# Altium project mxiot.PrjPcb
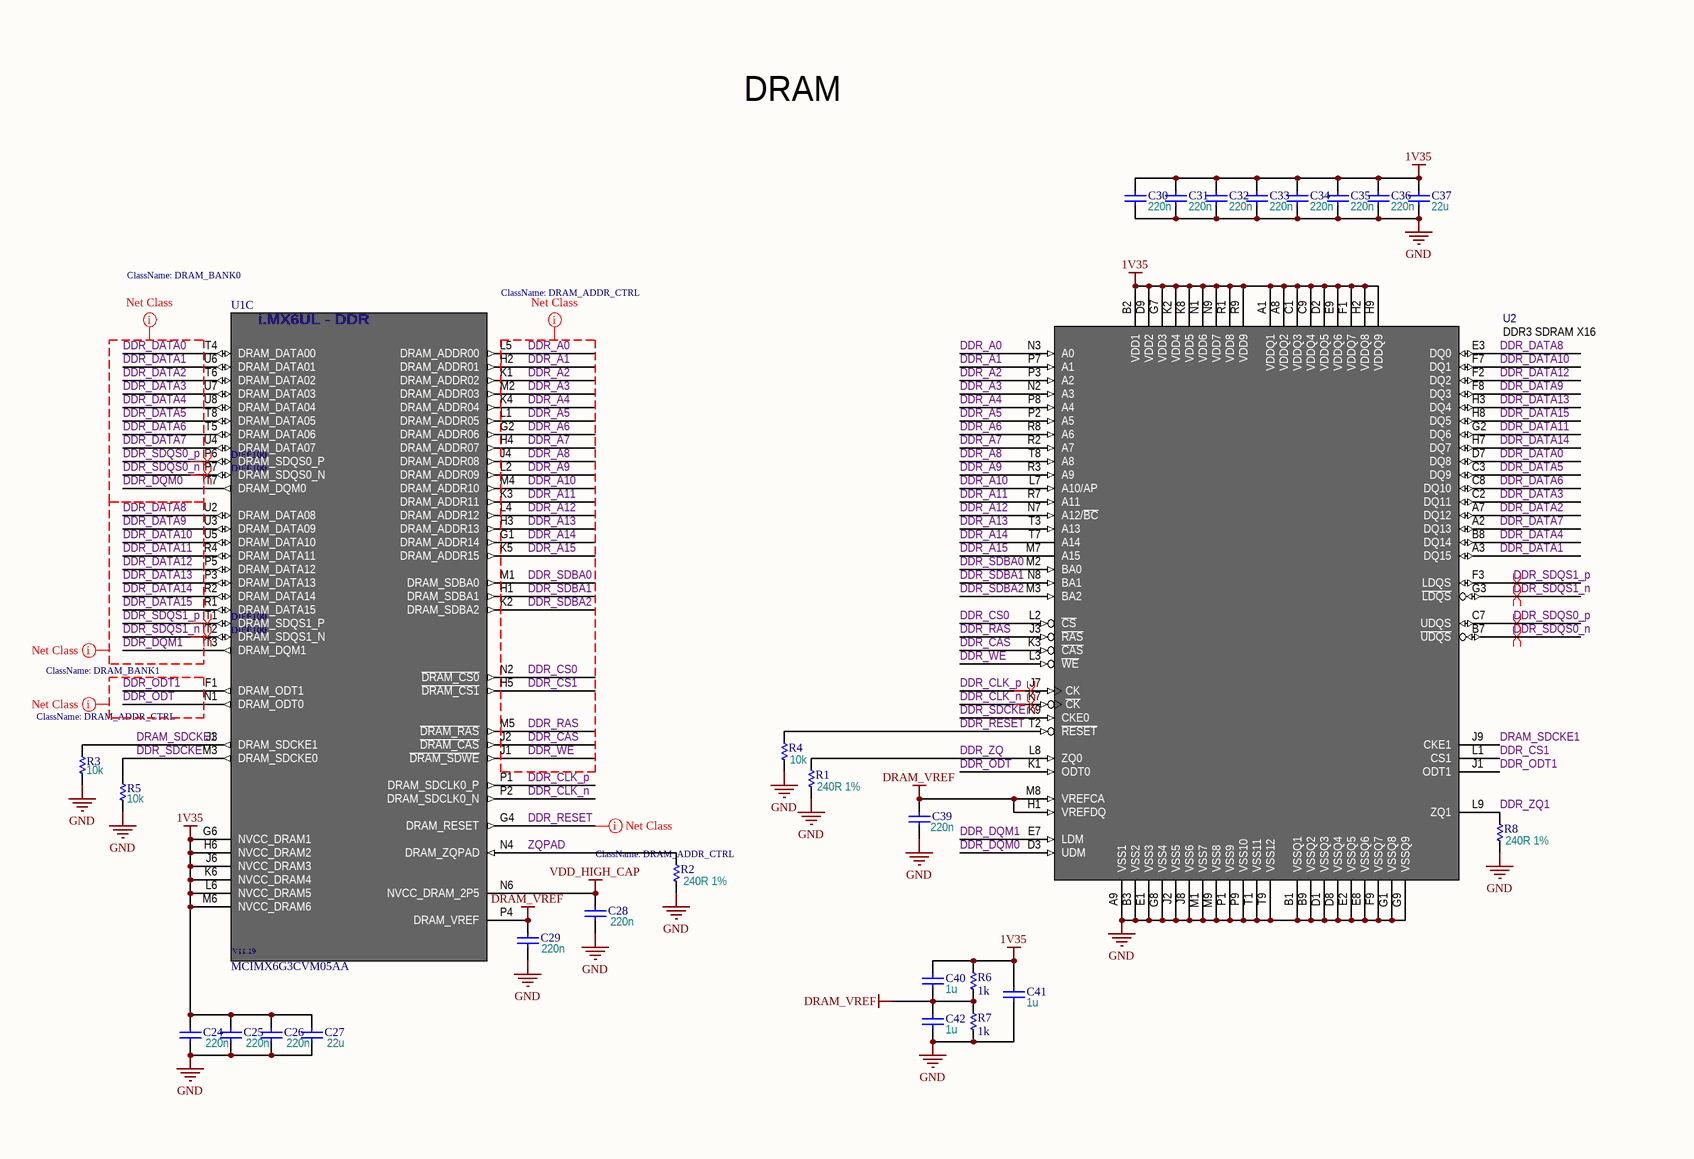
[diagram p0: mxiot.SchDoc, top left]
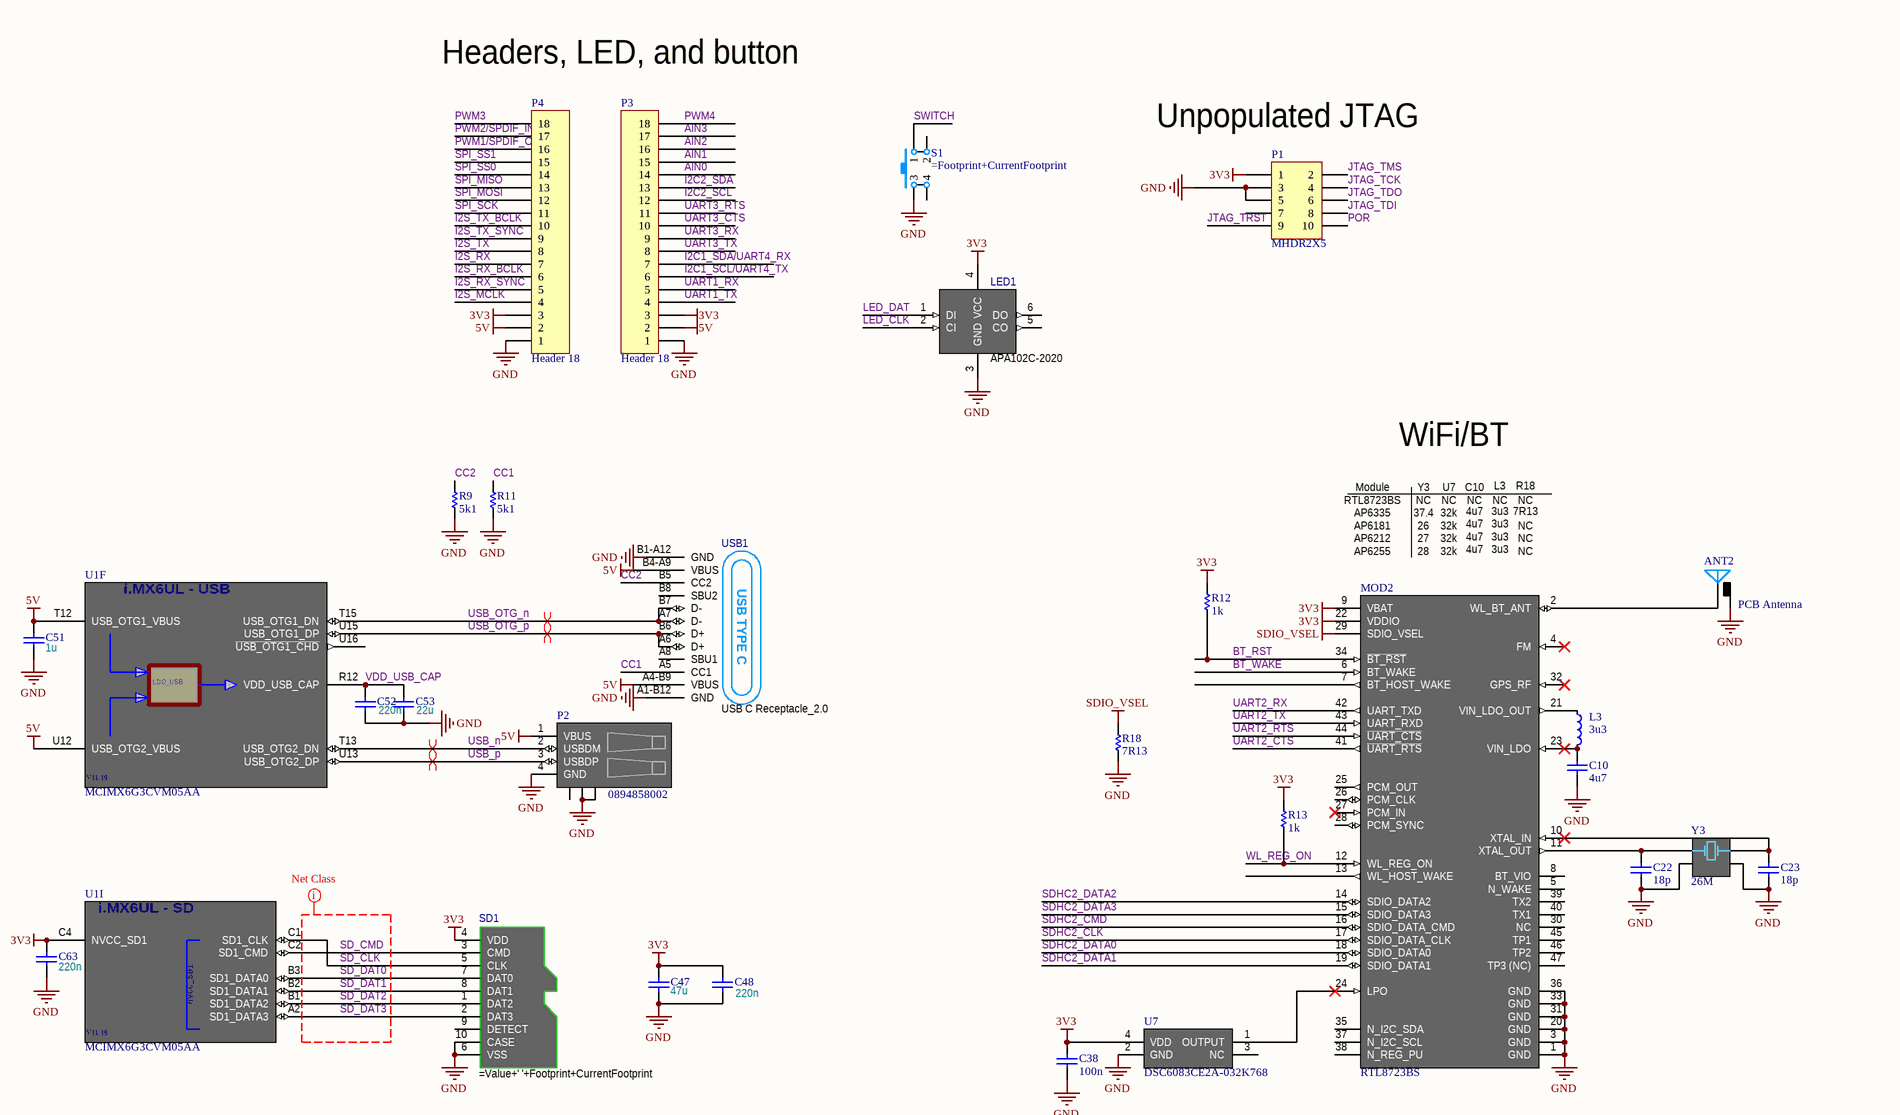
[diagram p1: mxiot.SchDoc, top right]
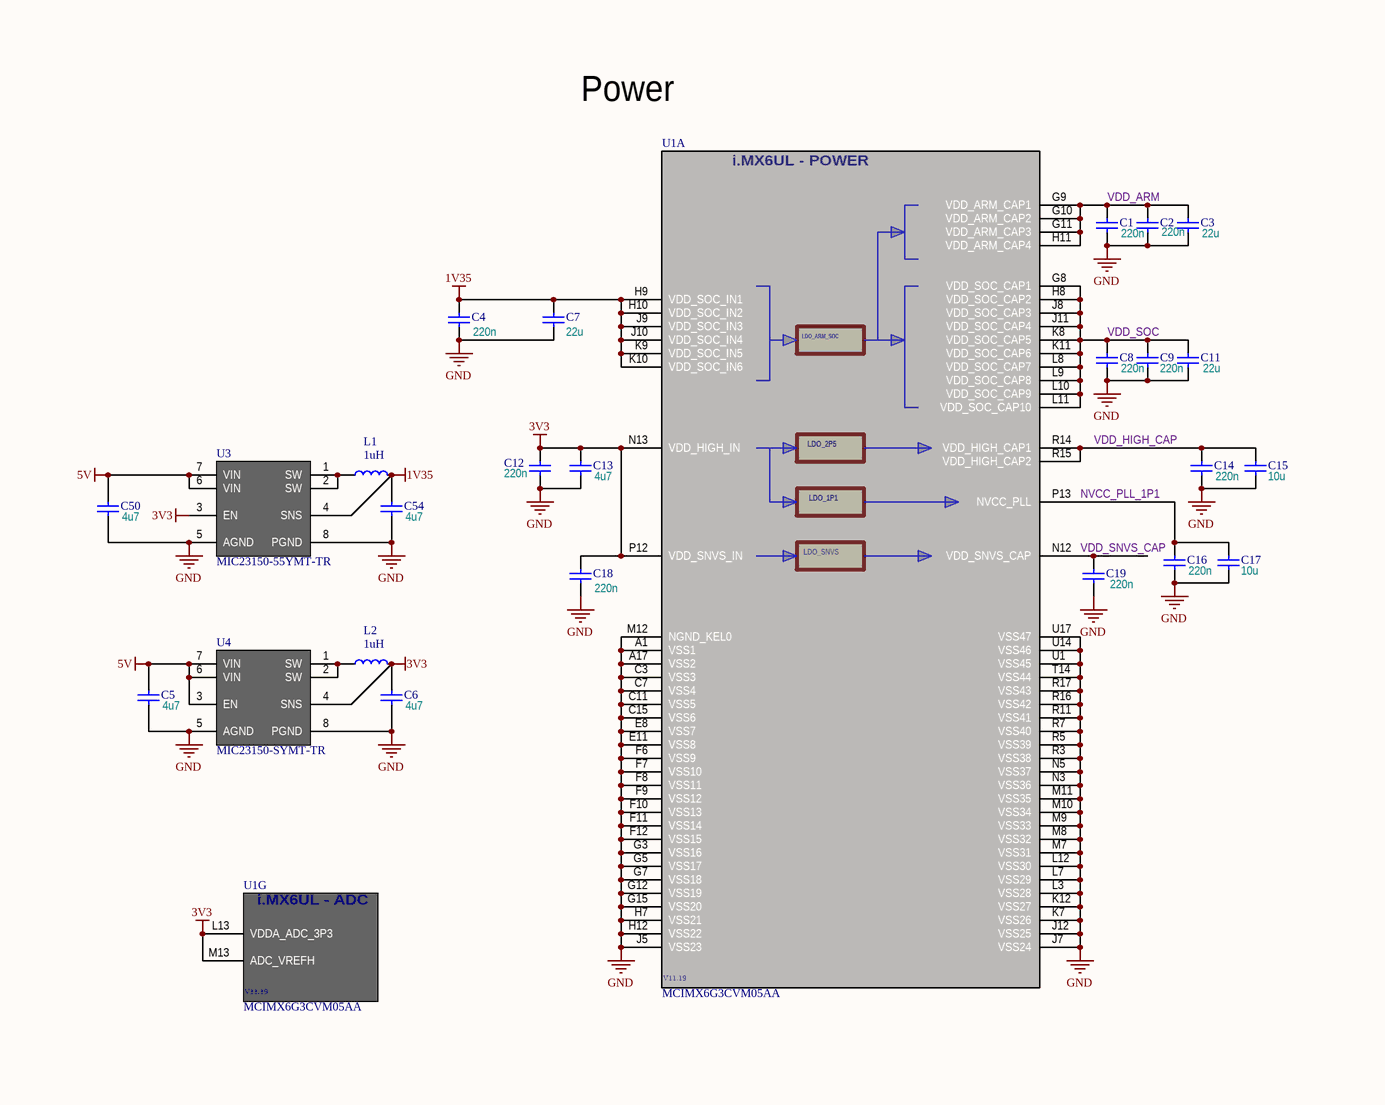
[diagram p2: mxiot.SchDoc, bottom left]
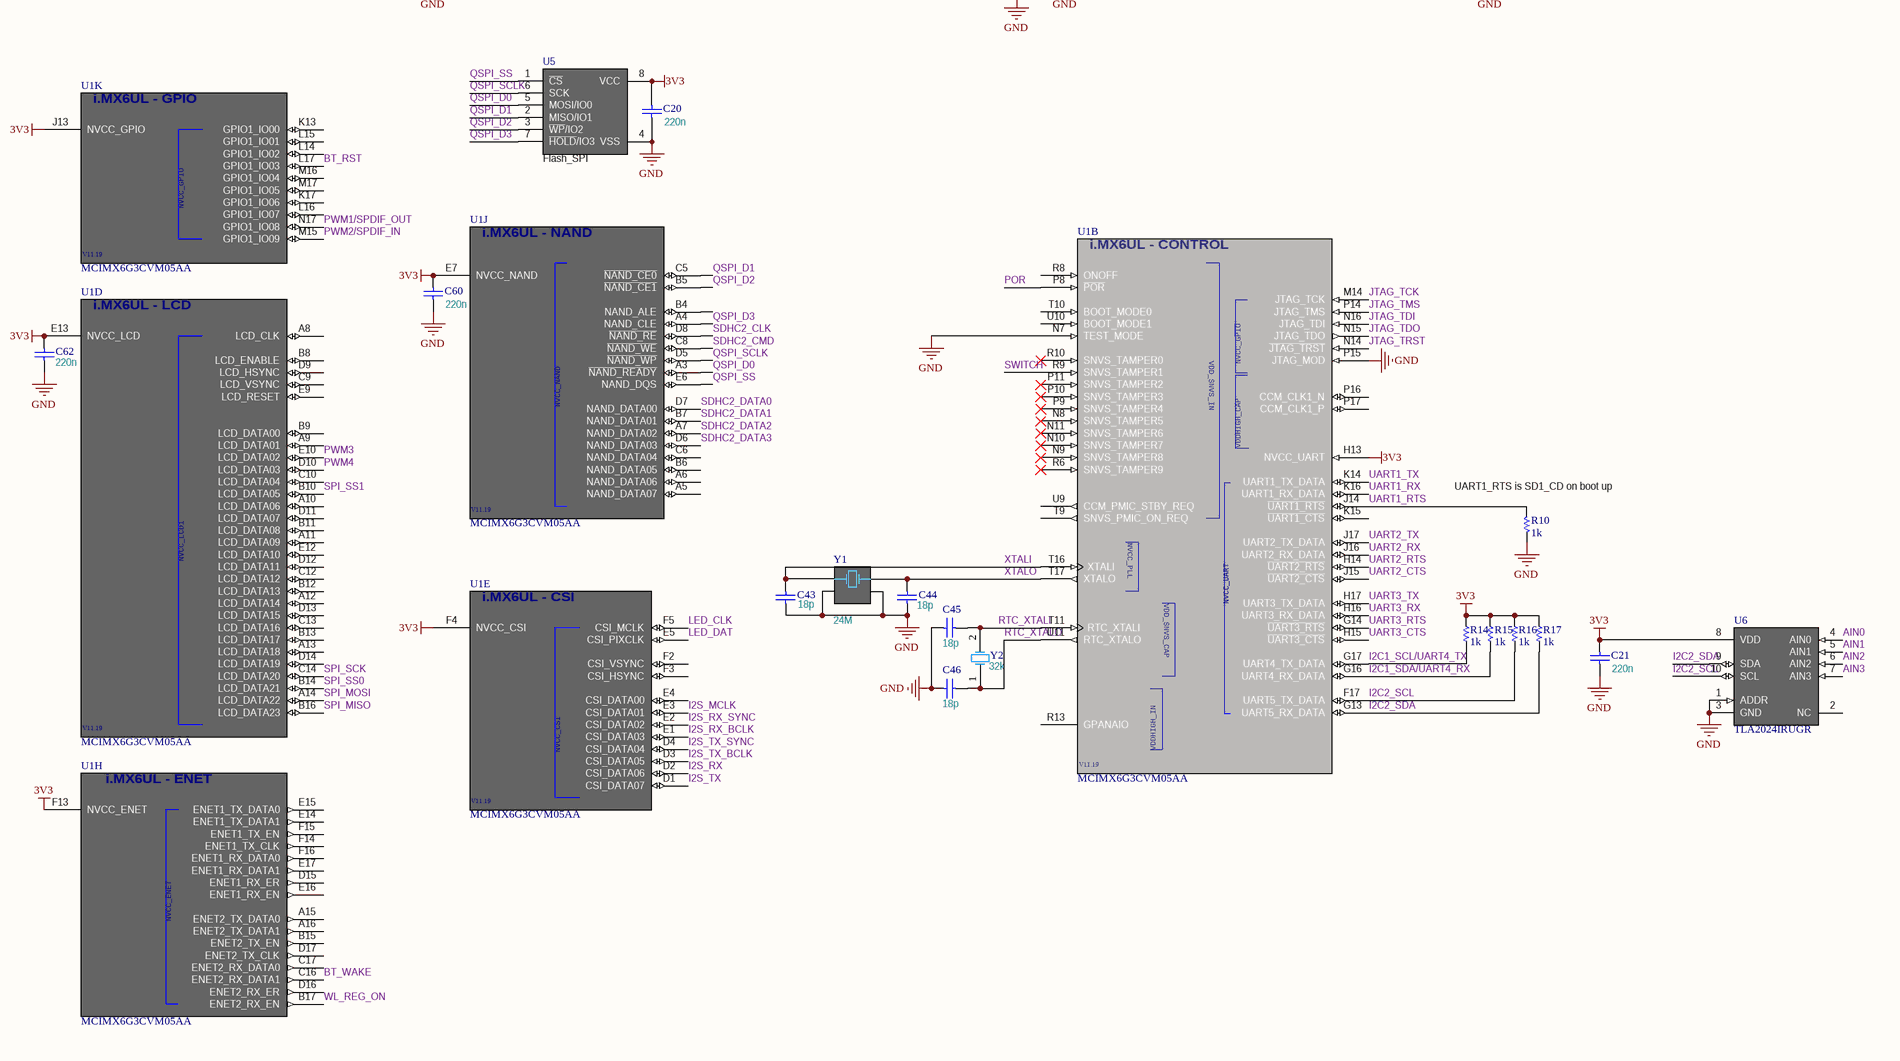
[diagram p3: mxiot.SchDoc, bottom right]
1 sheet, 97 parts. Net scope: global (net labels, ports and power ports of the same name join across sheets).
Board file: mxiot.PcbDoc

## Sheet mxiot.SchDoc
size 762 x 457 mm

### Parts
ANT2  PCB Antenna  [AN043FLIPPED]  (net tie, no BOM)
C1  value 220n  [CAPC1005N]
C2  value 220n  [CAPC1005N]
C3  value 22u  [CAPC1608N]
C4  value 220n  [CAPC1005N]
C5  value 4u7  [CAPC1608N]
C6  value 4u7  [CAPC1608N]
C7  value 22u  [CAPC1608N]
C8  value 220n  [CAPC1005N]
C9  value 220n  [CAPC1005N]
C10  4u7  [CAPC1608N]  (no BOM)
C11  value 22u  [CAPC1608N]
C12  value 220n  [CAPC1005N]
C13  value 4u7  [CAPC1608N]
C14  value 220n  [CAPC1005N]
C15  value 10u  [CAPC1608N]
C16  value 220n  [CAPC1005N]
C17  value 10u  [CAPC1608N]
C18  value 220n  [CAPC1005N]
C19  value 220n  [CAPC1005N]
C20  value 220n  [CAPC1005N]
C21  value 220n  [CAPC1005N]
C22  18p  [CAPC1005N]  (no BOM)
C23  18p  [CAPC1005N]  (no BOM)
C24  value 220n  [CAPC1005N]
C25  value 220n  [CAPC1005N]
C26  value 220n  [CAPC1005N]
C27  value 22u  [CAPC1608N]
C28  value 220n  [CAPC1005N]
C29  value 220n  [CAPC1005N]
C30  value 220n  [CAPC1005N]
C31  value 220n  [CAPC1005N]
C32  value 220n  [CAPC1005N]
C33  value 220n  [CAPC1005N]
C34  value 220n  [CAPC1005N]
C35  value 220n  [CAPC1005N]
C36  value 220n  [CAPC1005N]
C37  value 22u  [CAPC1608N]
C38  100n  [CAPC1005N]  (no BOM)
C39  value 220n  [CAPC1005N]
C40  value 1u  [CAPC1005N]
C41  value 1u  [CAPC1005N]
C42  value 1u  [CAPC1005N]
C43  value 18p  [CAPC1005N]
C44  value 18p  [CAPC1005N]
C45  value 18p  [CAPC1005N]
C46  value 18p  [CAPC1005N]
C47  value 47u  [CAPC2012L]
C48  value 220n  [CAPC1005N]
C50  value 4u7  [CAPC1608N]
C51  value 1u  [CAPC1005N]
C52  value 220n  [CAPC1005N]
C53  value 22u  [CAPC1608N]
C54  value 4u7  [CAPC1608N]
C60  value 220n  [CAPC1005N]
C62  value 220n  [CAPC1005N]
C63  value 220n  [CAPC1005N]
L1  value 1uH  [INDC2520X12N]
L2  value 1uH  [INDC2520X12N]
L3  value 3u3  [INDC2520X12N]  (hidden comment: Inductor)  (no BOM)
LED1  APA102C-2020  [APA102-2020]
MOD2  RTL8723BS  [AP1212_44N]
P1  MHDR2X5  [MHDR2X5SMD]  (no BOM)
P2  0894858002  [0894858002]
P3  Header 18  [HDR1X18]
P4  Header 18  [HDR1X18]
R1  value 240R 1%  [RESC1005N]
R2  value 240R 1%  [RESC1005N]
R3  value 10k  [RESC1005N]
R4  value 10k  [RESC1005N]
R5  value 10k  [RESC1005N]
R6  value 1k  [RESC1005N]
R7  value 1k  [RESC1005N]
R8  value 240R 1%  [RESC1005N]
R9  value 5k1  [RESC1005N]
R10  value 1k  [RESC1005N]
R11  value 5k1  [RESC1005N]
R12  value 1k  [RESC1005N]
R13  value 1k  [RESC1005N]
R14  value 1k  [RESC1005N]
R15  value 1k  [RESC1005N]
R16  value 1k  [RESC1005N]
R17  value 1k  [RESC1005N]
R18  7R13  [RESC1005N]  (no BOM)
S1  (no value)  [TACTILE-SW-SMD-4.2X3.2X2.5]
SD1  (no value)  [47309-2851]
U1  MCIMX6G3CVM05AA  [BGA289C80P17X17_1400X1400X132]  (parts A,B,C,D,E,F,G,H,I,J,K of 11)
U2  DDR3 SDRAM X16  [BGA96C80P9X16_COMBO]
U3  MIC23150-55YMT-TR  [DFN50P200X80-8N]
U4  MIC23150-SYMT-TR  [DFN50P200X80-8N]
U5  Flash_SPI  [SON127P800X80_HS-COMBO-9N]
U6  TLA2024IRUGR  [RUG_N]
U7  DSC6083CE2A-032K768  [XTAL3225-4-N]  (no BOM)
USB1  USB C Receptacle_2.0  [TYPE-C16PIN-CONNECTOR]
Y1  value 24M  [XTAL3225-4-N]
Y2  value 32k  [ABS07]
Y3  26M  [XTAL3225-4-N]  (no BOM)

### Nets
1V35: C4.2 C7.2 C24.2 C25.2 C26.2 C27.2 C30.2 C31.2 C32.2 C33.2 C34.2 C35.2 C36.2 C37.2 C40.2 C41.2 C54.2 L1.2 R6.2 U1.G6(NVCC_DRAM1) U1.H6(NVCC_DRAM2) U1.H9(VDD_SOC_IN1) U1.H10(VDD_SOC_IN2) U1.J6(NVCC_DRAM3) U1.J9(VDD_SOC_IN3) U1.J10(VDD_SOC_IN4) U1.K6(NVCC_DRAM4) U1.K9(VDD_SOC_IN5) U1.K10(VDD_SOC_IN6) U1.L6(NVCC_DRAM5) U1.M6(NVCC_DRAM6) U2.A1(VDDQ1) U2.A8(VDDQ2) U2.B2(VDD1) U2.C1(VDDQ3) U2.C9(VDDQ4) U2.D2(VDDQ5) U2.D9(VDD2) U2.E9(VDDQ6) U2.F1(VDDQ7) U2.G7(VDD3) U2.H2(VDDQ8) U2.H9(VDDQ9) U2.K2(VDD4) U2.K8(VDD5) U2.N1(VDD6) U2.N9(VDD7) U2.R1(VDD8) U2.R9(VDD9) U3.4(SNS)
3V3: C6.2 C12.2 C13.2 C18.2 C20.2 C21.2 C38.2 C47.2 C48.2 C60.2 C62.2 C63.2 L2.2 LED1.4(VCC) MOD2.9(VBAT) MOD2.22(VDDIO) P1.1 P3.3 P4.3 R12.2 R13.2 R14.2 R15.2 R16.2 R17.2 SD1.4(VDD) U1.C4(NVCC_SD1) U1.E7(NVCC_NAND) U1.E13(NVCC_LCD) U1.F4(NVCC_CSI) U1.F13(NVCC_ENET) U1.H13(NVCC_UART) U1.J13(NVCC_GPIO) U1.L13(VDDA_ADC_3P3) U1.M13(ADC_VREFH) U1.N13(VDD_HIGH_IN) U1.P12(VDD_SNVS_IN) U3.3(EN) U4.4(SNS) U5.8(VCC) U6.8(VDD) U7.4(VDD)
5V: C5.2 C50.2 C51.2 P2.1(VBUS) P3.2 P4.2 U1.T12(USB_OTG1_VBUS) U1.U12(USB_OTG2_VBUS) U3.6(VIN) U3.7(VIN) U4.3(EN) U4.6(VIN) U4.7(VIN) USB1.A4-B9(VBUS) USB1.B4-A9(VBUS)
DRAM_VREF: C29.2 C39.2 C40.1 C42.2 R6.1 R7.2 U1.P4(DRAM_VREF) U2.H1(VREFDQ) U2.M8(VREFCA)
GND: ANT2.2(GND) C1.1 C2.1 C3.1 C4.1 C5.1 C6.1 C7.1 C8.1 C9.1 C10.1 C11.1 C12.1 C13.1 C14.1 C15.1 C16.1 C17.1 C18.1 C19.1 C20.1 C21.1 C22.1 C23.1 C24.1 C25.1 C26.1 C27.1 C28.1 C29.1 C30.1 C31.1 C32.1 C33.1 C34.1 C35.1 C36.1 C37.1 C38.1 C39.1 C41.1 C42.1 C43.1 C44.1 C45.1 C46.1 C47.1 C48.1 C50.1 C51.1 C52.1 C53.1 C54.1 C60.1 C62.1 C63.1 LED1.3(GND) MOD2.1(GND) MOD2.3(GND) MOD2.20(GND) MOD2.31(GND) MOD2.33(GND) MOD2.36(GND) P1.3 P1.5 P2.4(GND) P2.MH1 P2.MH2 P3.1 P4.1 R1.2 R2.2 R3.1 R4.1 R5.1 R7.1 R8.2 R9.1 R10.1 R11.1 R18.1 S1.3 SD1.6(VSS) SD1.10(CASE) U1.A1(VSS1) U1.A17(VSS2) U1.C3(VSS3) U1.C7(VSS4) U1.C11(VSS5) U1.C15(VSS6) U1.E8(VSS7) U1.E11(VSS8) U1.F6(VSS9) U1.F7(VSS10) U1.F8(VSS11) U1.F9(VSS12) U1.F10(VSS13) U1.F11(VSS14) U1.F12(VSS15) U1.G3(VSS16) U1.G5(VSS17) U1.G7(VSS18) U1.G12(VSS19) U1.G15(VSS20) U1.H7(VSS21) U1.H12(VSS22) U1.J5(VSS23) U1.J7(VSS24) U1.J12(VSS25) U1.K7(VSS26) U1.K12(VSS27) U1.L3(VSS28) U1.L7(VSS29) U1.L12(VSS30) U1.M7(VSS31) U1.M8(VSS32) U1.M9(VSS33) U1.M10(VSS34) U1.M11(VSS35) U1.M12(NGND_KEL0) U1.N3(VSS36) U1.N5(VSS37) U1.N7(TEST_MODE) U1.P15(JTAG_MOD) U1.R3(VSS38) U1.R5(VSS39) U1.R7(VSS40) U1.R11(VSS41) U1.R16(VSS42) U1.R17(VSS43) U1.T14(VSS44) U1.U1(VSS45) U1.U14(VSS46) U1.U17(VSS47) U2.A9(VSS1) U2.B1(VSSQ1) U2.B3(VSS2) U2.B9(VSSQ2) U2.D1(VSSQ3) U2.D8(VSSQ4) U2.E1(VSS3) U2.E2(VSSQ5) U2.E8(VSSQ6) U2.F9(VSSQ7) U2.G1(VSSQ8) U2.G8(VSS4) U2.G9(VSSQ9) U2.J2(VSS5) U2.J8(VSS6) U2.M1(VSS7) U2.M9(VSS8) U2.P1(VSS9) U2.P9(VSS10) U2.T1(VSS11) U2.T9(VSS12) U3.5(AGND) U3.8(PGND) U4.5(AGND) U4.8(PGND) U5.4(VSS) U6.1(ADDR) U6.3(GND) U7.2(GND) USB1.A1-B12(GND) USB1.B1-A12(GND) Y1.2 Y1.4 Y3.2 Y3.4
SDIO_VSEL: MOD2.29(SDIO_VSEL) R18.2
VDD_HIGH_CAP: C14.2 C15.2 C28.2 U1.N6(NVCC_DRAM_2P5) U1.R14(VDD_HIGH_CAP1) U1.R15(VDD_HIGH_CAP2)
AIN0: P3.14 U6.4(AIN0)
AIN1: P3.15 U6.5(AIN1)
AIN2: P3.16 U6.6(AIN2)
AIN3: P3.17 U6.7(AIN3)
BT_RST: MOD2.34(~{BT_RST}) R12.1 U1.L17(GPIO1_IO03)
BT_WAKE: MOD2.6(BT_WAKE) U1.C16(ENET2_RX_DATA1)
CC1: R11.2 USB1.A5(CC1)
CC2: R9.2 USB1.B5(CC2)
DDR_A0: U1.L5(DRAM_ADDR00) U2.N3(A0)
DDR_A1: U1.H2(DRAM_ADDR01) U2.P7(A1)
DDR_A2: U1.K1(DRAM_ADDR02) U2.P3(A2)
DDR_A3: U1.M2(DRAM_ADDR03) U2.N2(A3)
DDR_A4: U1.K4(DRAM_ADDR04) U2.P8(A4)
DDR_A5: U1.L1(DRAM_ADDR05) U2.P2(A5)
DDR_A6: U1.G2(DRAM_ADDR06) U2.R8(A6)
DDR_A7: U1.H4(DRAM_ADDR07) U2.R2(A7)
DDR_A8: U1.J4(DRAM_ADDR08) U2.T8(A8)
DDR_A9: U1.L2(DRAM_ADDR09) U2.R3(A9)
DDR_A10: U1.M4(DRAM_ADDR10) U2.L7(A10/AP)
DDR_A11: U1.K3(DRAM_ADDR11) U2.R7(A11)
DDR_A12: U1.L4(DRAM_ADDR12) U2.N7(A12/~{BC})
DDR_A13: U1.H3(DRAM_ADDR13) U2.T3(A13)
DDR_A14: U1.G1(DRAM_ADDR14) U2.T7(A14)
DDR_A15: U1.K5(DRAM_ADDR15) U2.M7(A15)
DDR_CAS: U1.J2(~{DRAM_CAS}) U2.K3(~{CAS})
DDR_CLK_n: U1.P2(DRAM_SDCLK0_N) U2.K7(~{CK})
DDR_CLK_p: U1.P1(DRAM_SDCLK0_P) U2.J7(CK)
DDR_CS0: U1.N2(~{DRAM_CS0}) U2.L2(~{CS})
DDR_CS1: U1.H5(~{DRAM_CS1}) U2.L1(CS1)
DDR_DATA0: U1.T4(DRAM_DATA00) U2.D7(DQ8)
DDR_DATA1: U1.U6(DRAM_DATA01) U2.A3(DQ15)
DDR_DATA2: U1.T6(DRAM_DATA02) U2.A7(DQ12)
DDR_DATA3: U1.U7(DRAM_DATA03) U2.C2(DQ11)
DDR_DATA4: U1.U8(DRAM_DATA04) U2.B8(DQ14)
DDR_DATA5: U1.T8(DRAM_DATA05) U2.C3(DQ9)
DDR_DATA6: U1.T5(DRAM_DATA06) U2.C8(DQ10)
DDR_DATA7: U1.U4(DRAM_DATA07) U2.A2(DQ13)
DDR_DATA8: U1.U2(DRAM_DATA08) U2.E3(DQ0)
DDR_DATA9: U1.U3(DRAM_DATA09) U2.F8(DQ3)
DDR_DATA10: U1.U5(DRAM_DATA10) U2.F7(DQ1)
DDR_DATA11: U1.R4(DRAM_DATA11) U2.G2(DQ6)
DDR_DATA12: U1.P5(DRAM_DATA12) U2.F2(DQ2)
DDR_DATA13: U1.P3(DRAM_DATA13) U2.H3(DQ4)
DDR_DATA14: U1.R2(DRAM_DATA14) U2.H7(DQ7)
DDR_DATA15: U1.R1(DRAM_DATA15) U2.H8(DQ5)
DDR_DQM0: U1.T7(DRAM_DQM0) U2.D3(UDM)
DDR_DQM1: U1.T3(DRAM_DQM1) U2.E7(LDM)
DDR_ODT: U1.N1(DRAM_ODT0) U2.K1(ODT0)
DDR_ODT1: U1.F1(DRAM_ODT1) U2.J1(ODT1)
DDR_RAS: U1.M5(~{DRAM_RAS}) U2.J3(~{RAS})
DDR_RESET: R4.2 U1.G4(DRAM_RESET) U2.T2(~{RESET})
DDR_SDBA0: U1.M1(DRAM_SDBA0) U2.M2(BA0)
DDR_SDBA1: U1.H1(DRAM_SDBA1) U2.N8(BA1)
DDR_SDBA2: U1.K2(DRAM_SDBA2) U2.M3(BA2)
DDR_SDCKE: R5.2 U1.M3(DRAM_SDCKE0) U2.K9(CKE0)
DDR_SDQS0_n: U1.P7(DRAM_SDQS0_N) U2.B7(~{UDQS})
DDR_SDQS0_p: U1.P6(DRAM_SDQS0_P) U2.C7(UDQS)
DDR_SDQS1_n: U1.T2(DRAM_SDQS1_N) U2.G3(~{LDQS})
DDR_SDQS1_p: U1.T1(DRAM_SDQS1_P) U2.F3(LDQS)
DDR_WE: U1.J1(~{DRAM_SDWE}) U2.L3(~{WE})
DDR_ZQ: R1.1 U2.L8(ZQ0)
DDR_ZQ1: R8.1 U2.L9(ZQ1)
DRAM_SDCKE1: R3.2 U1.J3(DRAM_SDCKE1) U2.J9(CKE1)
I2C1_SCL/UART4_TX: P3.6 R14.1 U1.G17(UART4_TX_DATA)
I2C1_SDA/UART4_RX: P3.7 R15.1 U1.G16(UART4_RX_DATA)
I2C2_SCL: P3.12 R16.1 U1.F17(UART5_TX_DATA) U6.10(SCL)
I2C2_SDA: P3.13 R17.1 U1.G13(UART5_RX_DATA) U6.9(SDA)
I2S_MCLK: P4.4 U1.E3(CSI_DATA01)
I2S_RX: P4.7 U1.D2(CSI_DATA06)
I2S_RX_BCLK: P4.6 U1.E1(CSI_DATA03)
I2S_RX_SYNC: P4.5 U1.E2(CSI_DATA02)
I2S_TX: P4.8 U1.D1(CSI_DATA07)
I2S_TX_BCLK: P4.10 U1.D3(CSI_DATA05)
I2S_TX_SYNC: P4.9 U1.D4(CSI_DATA04)
JTAG_TCK: P1.4 U1.M14(JTAG_TCK)
JTAG_TDI: P1.8 U1.N16(JTAG_TDI)
JTAG_TDO: P1.6 U1.N15(JTAG_TDO)
JTAG_TMS: P1.2 U1.P14(JTAG_TMS)
JTAG_TRST: P1.9 U1.N14(~{JTAG_TRST})
LED_CLK: LED1.2(CI) U1.F5(CSI_MCLK)
LED_DAT: LED1.1(DI) U1.E5(CSI_PIXCLK)
NVCC_PLL_1P1: C16.2 C17.2 U1.P13(NVCC_PLL)
POR: P1.10 U1.P8(~{POR})
PWM1/SPDIF_OUT: P4.16 U1.N17(GPIO1_IO08)
PWM2/SPDIF_IN: P4.17 U1.M15(GPIO1_IO09)
PWM3: P4.18 U1.E10(LCD_DATA02)
PWM4: P3.18 U1.D10(LCD_DATA03)
QSPI_D0: U1.A3(~{NAND_READY}) U5.5(MOSI/IO0)
QSPI_D1: U1.C5(~{NAND_CE0}) U5.2(MISO/IO1)
QSPI_D2: U1.B5(~{NAND_CE1}) U5.3(~{WP}/IO2)
QSPI_D3: U1.A4(NAND_CLE) U5.7(~{HOLD}/IO3)
QSPI_SCLK: U1.D5(~{NAND_WP}) U5.6(SCK)
QSPI_SS: U1.E6(NAND_DQS) U5.1(~{CS})
RTC_XTALI: C45.2 U1.T11(RTC_XTALI) Y2.2(OSC2)
RTC_XTALO: C46.2 U1.U11(RTC_XTALO) Y2.1(OSC1)
SD_CLK: SD1.5(CLK) U1.C1(SD1_CLK)
SD_CMD: SD1.3(CMD) U1.C2(SD1_CMD)
SD_DAT0: SD1.7(DAT0) U1.B3(SD1_DATA0)
SD_DAT1: SD1.8(DAT1) U1.B2(SD1_DATA1)
SD_DAT2: SD1.1(DAT2) U1.B1(SD1_DATA2)
SD_DAT3: SD1.2(DAT3) U1.A2(SD1_DATA3)
SDHC2_CLK: MOD2.17(SDIO_DATA_CLK) U1.D8(~{NAND_RE})
SDHC2_CMD: MOD2.16(SDIO_DATA_CMD) U1.C8(~{NAND_WE})
SDHC2_DATA0: MOD2.18(SDIO_DATA0) U1.D7(NAND_DATA00)
SDHC2_DATA1: MOD2.19(SDIO_DATA1) U1.B7(NAND_DATA01)
SDHC2_DATA2: MOD2.14(SDIO_DATA2) U1.A7(NAND_DATA02)
SDHC2_DATA3: MOD2.15(SDIO_DATA3) U1.D6(NAND_DATA03)
SPI_MISO: P4.13 U1.B16(LCD_DATA23)
SPI_MOSI: P4.12 U1.A14(LCD_DATA22)
SPI_SCK: P4.11 U1.C14(LCD_DATA20)
SPI_SS0: P4.14 U1.B14(LCD_DATA21)
SPI_SS1: P4.15 U1.B10(LCD_DATA05)
SWITCH: S1.1 U1.R9(SNVS_TAMPER1)
UART1_RTS: R10.2 U1.J14(~{UART1_RTS})
UART1_RX: P3.5 U1.K16(UART1_RX_DATA)
UART1_TX: P3.4 U1.K14(UART1_TX_DATA)
UART2_CTS: MOD2.41(~{UART_RTS}) U1.J15(~{UART2_CTS})
UART2_RTS: MOD2.44(~{UART_CTS}) U1.H14(~{UART2_RTS})
UART2_RX: MOD2.42(UART_TXD) U1.J16(UART2_RX_DATA)
UART2_TX: MOD2.43(UART_RXD) U1.J17(UART2_TX_DATA)
UART3_CTS: P3.10 U1.H15(~{UART3_CTS})
UART3_RTS: P3.11 U1.G14(~{UART3_RTS})
UART3_RX: P3.9 U1.H16(UART3_RX_DATA)
UART3_TX: P3.8 U1.H17(UART3_TX_DATA)
USB_n: P2.2(USBDM) U1.T13(USB_OTG2_DN)
USB_OTG_n: U1.T15(USB_OTG1_DN) USB1.A7(D-) USB1.B7(D-)
USB_OTG_p: U1.U15(USB_OTG1_DP) USB1.A6(D+) USB1.B6(D+)
USB_p: P2.3(USBDP) U1.U13(USB_OTG2_DP)
VDD_ARM: C1.2 C2.2 C3.2 U1.G9(VDD_ARM_CAP1) U1.G10(VDD_ARM_CAP2) U1.G11(VDD_ARM_CAP3) U1.H11(VDD_ARM_CAP4)
VDD_SNVS_CAP: C19.2 U1.N12(VDD_SNVS_CAP)
VDD_SOC: C8.2 C9.2 C11.2 U1.G8(VDD_SOC_CAP1) U1.H8(VDD_SOC_CAP2) U1.J8(VDD_SOC_CAP3) U1.J11(VDD_SOC_CAP4) U1.K8(VDD_SOC_CAP5) U1.K11(VDD_SOC_CAP6) U1.L8(VDD_SOC_CAP7) U1.L9(VDD_SOC_CAP8) U1.L10(VDD_SOC_CAP9) U1.L11(VDD_SOC_CAP10)
VDD_USB_CAP: C52.2 C53.2 U1.R12(VDD_USB_CAP)
WL_REG_ON: MOD2.12(WL_REG_ON) R13.1 U1.B17(ENET2_RX_EN)
XTALI: C43.2 U1.T16(XTALI) Y1.1(OSC1)
XTALO: C44.2 U1.T17(XTALO) Y1.3(OSC2)
ZQPAD: R2.1 U1.N4(DRAM_ZQPAD)
NetANT2_1: ANT2.1(A) MOD2.2(WL_BT_ANT)
NetC10_2: C10.2 L3.2 MOD2.23(VIN_LDO)
NetC22_2: C22.2 MOD2.11(XTAL_OUT) Y3.3(OSC2)
NetC23_2: C23.2 MOD2.10(XTAL_IN) Y3.1(OSC1)
NetL1_1: L1.1 U3.1(SW) U3.2(SW)
NetL2_1: L2.1 U4.1(SW) U4.2(SW)
NetL3_1: L3.1 MOD2.21(VIN_LDO_OUT)
NetMOD2_24: MOD2.24(LPO) U7.1(OUTPUT)

Not connected (* = marked no-connect by the designer): LED1 5(CO) 6(DO); MOD2 4(FM)* 5(N_WAKE) 7(BT_HOST_WAKE) 8(BT_VIO) 13(WL_HOST_WAKE) 25(PCM_OUT) 26(PCM_CLK) 27(PCM_IN)* 28(PCM_SYNC) 30(NC) 32(GPS_RF)* 35(N_I2C_SDA) 37(N_I2C_SCL) 38(N_REG_PU) 39(TX2) 40(TX1) 45(TP1) 46(TP2) 47(TP3_(NC)); P1 7; P2 MH3; S1 2 4; SD1 9(DETECT); U1 A5(NAND_DATA07) A6(NAND_DATA06) A8(LCD_CLK) A9(LCD_DATA01) A10(LCD_DATA06) A11(LCD_DATA09) A12(LCD_DATA14) A13(LCD_DATA18) A15(ENET2_TX_DATA0) A16(ENET2_TX_DATA1) B4(NAND_ALE) B6(NAND_DATA05) B8(LCD_ENABLE) B9(LCD_DATA00) B11(LCD_DATA08) B12(LCD_DATA13) B13(LCD_DATA17) B15(ENET2_TX_EN) C6(NAND_DATA04) C9(LCD_VSYNC) C10(LCD_DATA04) C12(LCD_DATA12) C13(LCD_DATA16) C17(ENET2_RX_DATA0) D9(LCD_HSYNC) D11(LCD_DATA07) D12(LCD_DATA11) D13(LCD_DATA15) D14(LCD_DATA19) D15(ENET1_RX_ER) D16(ENET2_RX_ER) D17(ENET2_TX_CLK) E4(CSI_DATA00) E9(LCD_RESET) E12(LCD_DATA10) E14(ENET1_TX_DATA1) E15(ENET1_TX_DATA0) E16(ENET1_RX_EN) E17(ENET1_RX_DATA1) F2(CSI_VSYNC) F3(CSI_HSYNC) F14(ENET1_TX_CLK) F15(ENET1_TX_EN) F16(ENET1_RX_DATA0) K13(GPIO1_IO00) K15(~{UART1_CTS}) K17(GPIO1_IO06) L14(GPIO1_IO02) L15(GPIO1_IO01) L16(GPIO1_IO07) M16(GPIO1_IO04) M17(GPIO1_IO05) N8(SNVS_TAMPER5)* N9(SNVS_TAMPER8)* N10(SNVS_TAMPER7)* N11(SNVS_TAMPER6)* P9(SNVS_TAMPER4)* P10(SNVS_TAMPER3)* P11(SNVS_TAMPER2)* P16(CCM_CLK1_N) P17(CCM_CLK1_P) R6(SNVS_TAMPER9)* R8(ONOFF) R10(SNVS_TAMPER0)* R13(GPANAIO) T9(SNVS_PMIC_ON_REQ) T10(BOOT_MODE0) U9(CCM_PMIC_STBY_REQ) U10(BOOT_MODE1) U16(~{USB_OTG1_CHD}); U6 2(NC); U7 3(NC); USB1 A8(SBU1) B8(SBU2)

### Layout directives
differential pair: DDR_CLK_n, DDR_CLK_p, DDR_SDQS0_n, DDR_SDQS0_p, DDR_SDQS1_n, DDR_SDQS1_p, USB_n, USB_OTG_n, USB_OTG_p, USB_p
net class DRAM_ADDR_CTRL: DDR_A0, DDR_A1, DDR_A2, DDR_A3, DDR_A4, DDR_A5, DDR_A6, DDR_A7, DDR_A8, DDR_A9, DDR_A10, DDR_A11, DDR_A12, DDR_A13, DDR_A14, DDR_A15, DDR_CAS, DDR_CS0, DDR_CS1, DDR_ODT, DDR_ODT1, DDR_RAS, DDR_RESET, DDR_SDBA0, DDR_SDBA1, DDR_SDBA2, DDR_WE
differential pair; net class DIFF100: DDR_SDQS0_n, DDR_SDQS0_p, DDR_SDQS1_n, DDR_SDQS1_p
net class DRAM_BANK0: DDR_DATA0, DDR_DATA1, DDR_DATA2, DDR_DATA3, DDR_DATA4, DDR_DATA5, DDR_DATA6, DDR_DATA7, DDR_DQM0, DDR_SDQS0_n, DDR_SDQS0_p
net class DRAM_BANK1: DDR_DATA8, DDR_DATA9, DDR_DATA10, DDR_DATA11, DDR_DATA12, DDR_DATA13, DDR_DATA14, DDR_DATA15, DDR_DQM1, DDR_SDQS1_n, DDR_SDQS1_p
net class SDCARD: SD_CLK, SD_CMD, SD_DAT0, SD_DAT1, SD_DAT2, SD_DAT3

### Notes on the sheet
- Headers, LED, and button
- DRAM
- (near P1) Unpopulated JTAG
- Module
- WiFi/BT
- Y3
- U7
- C10
- RTL8723BS
- AP6335
- AP6181
- AP6212
- NC
- 37.4
- 26
- 27
- 32k
- 4u7
- L3
- 3u3
- R18
- 7R13
- AP6255
- 28
- Power
- (near R10) UART1_RTS is SD1_CD on boot up
- Revision
- Project:
- Sheet
- of
- Jay Carlson
  4442 Grandview Blvd
  Lincoln NE 68521-2026
- (in symbol MCIMX6G3CVM05AA, part A) i.MX6UL - POWER; LDO_ARM_SOC; LDO_2P5; LDO_1P1; LDO_SNVS; V11.19
- (in symbol MCIMX6G3CVM05AA, part B) i.MX6UL - CONTROL; VDDHIGH_CAP; VDDHIGH_IN; V11.19
- (in symbol MCIMX6G3CVM05AA, part C) i.MX6UL - DDR; V11.19
- (in symbol MCIMX6G3CVM05AA, part D) i.MX6UL - LCD; NVCC_LCD1; V11.19
- (in symbol MCIMX6G3CVM05AA, part E) i.MX6UL - CSI; V11.19
- (in symbol MCIMX6G3CVM05AA, part F) i.MX6UL - USB; LDO_USB; V11.19
- (in symbol MCIMX6G3CVM05AA, part G) i.MX6UL - ADC; V11.19
- (in symbol MCIMX6G3CVM05AA, part H) i.MX6UL - ENET
- (in symbol MCIMX6G3CVM05AA, part I) i.MX6UL - SD; V11.19
- (in symbol MCIMX6G3CVM05AA, part J) i.MX6UL - NAND; V11.19
- (in symbol MCIMX6G3CVM05AA, part K) i.MX6UL - GPIO; V11.19
- (in symbol USB C Receptacle_2.0) USB TYPE C

### Library data of the parts
ANT2 = Antenna_TwoPort: Generic Antenna; Published: 24-Mar-1999; LatestRevisionDate: 17-Jul-2002; LatestRevisionNote: Re-released for DXP Platform.; PackageReference: PIN1; Publisher: Altium Limited
C1-C4 C7-C12 C14-C48 C51-C53 C60 C62 C63 = Cap Semi: Capacitor (Semiconductor SIM Model); Published: 8-Jun-2000; LatestRevisionDate: 29-May-2009; LatestRevisionNote: IPC-7351 Footprint Added.; PackageReference: C1206; Publisher: Altium Limited; PackageDescription: Chip Capacitor
  C20 C21 C40-C46 C51 C60 C62 C63: Supplier 1: Digi-Key; Supplier Part Number 1: 490-5921-1-ND
  C47: Supplier 1: Digi-Key; Supplier Part Number 1: 490-6469-1-ND
  C48: Supplier 1: Digi-Key; Supplier Part Number 1: 490-5418-1-ND
C5 C6 C13 C50 C54 = Cap Semi: Chip Capacitor; Published: 8-Jun-2000; LatestRevisionDate: 29-May-2009; LatestRevisionNote: IPC-7351 Footprint Added.; PackageReference: C1206; Publisher: Altium Limited; PackageDescription: Chip Capacitor
L1 L2 = Inductor: Manufacturer: Samsung; Manufacturer Part Number: CIGW252010GL1R0MNE; Code_IEC: 1005; Core Material: Metal,Composite; Tolerance: 20%; Current Rating: 3.3A; Saturation Current: 3.7A; Shielding: Unshielded; DC Resistance (DCR): 40mR; Test Frequency: 1MHz; Published: 8-Jun-2000; LatestRevisionDate: 29-May-2009; LatestRevisionNote: IPC-7351 Footprint Added.; PackageReference: 0402-A; Publisher: Altium Limited; PackageDescription: Chip Inductor; Code_JEITA: 0402; Supplier 1: Digi-Key; Supplier Part Number 1: 1276-6932-1-ND; Stock 1: 587; Pricing 1: 1=0.21000, 10=0.18600, 100=0.12390, 500=0.10322, 1000=0.08671 (USD); RoHS: No; Mount: Surface Mount; Case/Package: 1008; Case Code (Imperial): 1008; Case Code (Metric): 2520; Min Operating Temperature: -40°C; Max Operating Temperature: 125°C; Packaging: Cut Tape; Inductance: 1uH; Composition: Wirewound; ComponentLink1URL: http://www.samsungsem.com/kr/support/product-search/inductor/CIGW252010GL1R0MNE.jsp?src-supplier=Digi-Key; ComponentLink1Description: http://www.samsungsem.com/kr/support/product-search/inductor/CIGW252010GL1R0MNE.jsp?src-supplier=Digi-Key
L3 = Inductor: Code_IEC: 1005; Published: 8-Jun-2000; LatestRevisionDate: 29-May-2009; LatestRevisionNote: IPC-7351 Footprint Added.; PackageReference: 0402-A; Publisher: Altium Limited; PackageDescription: Chip Inductor; Code_JEITA: 0402; Supplier 1: Digi-Key; Supplier Part Number 1: SRN2512-2R2MCT-ND
LED1 = APA102C
MOD2 = AP6XXX: 802.11 + BT + FM + GPS module
P1 = MHDR2X5: Header, 5-Pin, Dual row; LatestRevisionDate: 17-Jul-2002; LatestRevisionNote: Re-released for DXP Platform.; Publisher: Altium Limited; Supplier 1: Digi-Key; Supplier Part Number 1: 609-4054-ND
P2 = 0894858002: CONN RCPT USB R/A TYPE A; Manufacturer: Molex; Number of Contacts: 4; Gender: Receptacle; Number of Ports: 1; Max Voltage Rating (AC): 750V; Pitch: 1.4mm; Supplier 1: Digi-Key; Manufacturer Part Number: 0894858002; Stock 1: 33; Pricing 1: 1=1.75000, 10=1.58500, 25=1.48840, 50=1.42360, 100=1.35890, 250=1.22948, 500=1.13242, 1000=0.97065, 2500=0.90594 (USD); RoHS: Yes; Mount: Through Hole,Vertical; Contact Material: Bronze; Contact Plating: Gold,Tin; Number of Terminals: 4; Housing Material: Nylon; Min Operating Temperature: 0°C; Max Operating Temperature: 50°C; Packaging: Tray; Termination: Solder; Orientation: Right Angle; Connector Type: USB; Package Quantity: 1600; Features: Shielded; Length: 7.5mm; Depth: 14mm; ComponentLink1URL: http://components.arrow.com/part/dataview/0323_01056087?src-supplier=Arrow+Europe; ComponentLink1Description: http://components.arrow.com/part/dataview/0323_01056087?src-supplier=Arrow+Europe; ComponentLink2URL: http://components.arrow.com/part/dataview/41628271S7299894N3303?src-supplier=Arrow; ComponentLink2Description: http://components.arrow.com/part/dataview/41628271S7299894N3303?src-supplier=Arrow; ComponentLink3URL: https://www.molex.com/pdm_docs/sd/894858000_sd.pdf?src-supplier=Digi-Key; ComponentLink3Description: https://www.molex.com/pdm_docs/sd/894858000_sd.pdf?src-supplier=Digi-Key; Supplier Part Number 1: WM8627-ND
P3 P4 = Header 18: Header, 18-Pin; LatestRevisionDate: 17-Jul-2002; LatestRevisionNote: Re-released for DXP Platform.; Publisher: Altium Limited
R1 R2 R8 = Res Semi: Semiconductor Resistor; Manufacturer: Yageo; Manufacturer Part Number: RC0402FR-07240RL; Published: 8-Jun-2000; LatestRevisionDate: 17-Jul-2002; LatestRevisionNote: Re-released for DXP Platform.; PackageReference: AXIAL-0.5; Publisher: Altium Limited; PackageDescription: Axial Device, Thru-Hole; 2 Leads; 0.5 in Pin Spacing; Supplier 1: Digi-Key; Supplier Part Number 1: 311-240LRCT-ND
R3-R5 R18 = Res Semi: Semiconductor Resistor; Published: 8-Jun-2000; LatestRevisionDate: 17-Jul-2002; LatestRevisionNote: Re-released for DXP Platform.; PackageReference: AXIAL-0.5; Publisher: Altium Limited; PackageDescription: Axial Device, Thru-Hole; 2 Leads; 0.5 in Pin Spacing
R6 R7 R9-R17 = Res Chip: Chip Resistor; Tolerance: %; Manufacturer 1: *; Manufacturer 2: *; Manufacturer Part Number 2: *; Manufacturer Part Number 1: *; Supplier Part Number 2: *; Supplier Part Number 1: *; Supplier 1: *; Supplier 2: *
S1 = TACTILE-SW4: Switch
SD1 = MicroSD Card Detect: microSD card memory connector; Supplier 1: Digi-Key; Supplier Part Number 1: WM6701TR-ND; Value: MicroSD
U1 = MCIMX6G3CVM05AA: CLASS: IC
U3 = MIC23150-55YMT-TR: DC/DC 1.35V 2A; Manufacturer: Microchip; Supplier 1: Digi-Key; Manufacturer Part Number: MIC23150-55YMT-TR; Stock 1: 1580; Pricing 1: 1=1.37000, 25=1.14000, 100=1.04000 (USD); RoHS: Yes; ComponentLink1URL: http://www.mouser.com/ds/2/495/mic23150-480742.pdf?src-supplier=Mouser; ComponentLink1Description: http://www.mouser.com/ds/2/495/mic23150-480742.pdf?src-supplier=Mouser; ComponentLink2URL: http://components.arrow.com/part/dataview/48472473S9794733N1374?src-supplier=Arrow; ComponentLink2Description: http://components.arrow.com/part/dataview/48472473S9794733N1374?src-supplier=Arrow; ComponentLink3URL: http://www.micrel.com/_PDF/mic23150.pdf?src-supplier=Future+Electronics; ComponentLink3Description: http://www.micrel.com/_PDF/mic23150.pdf?src-supplier=Future+Electronics; Supplier Part Number 1: 576-3651-1-ND
U4 = MIC23150-SYMT-TR: DC/DC 3.3V 2A; Manufacturer: Microchip; Supplier 1: Digi-Key; Manufacturer Part Number: MIC23150-SYMT-TR; Stock 1: 11793; Pricing 1: 1=1.37000, 25=1.14000, 100=1.04000 (USD); RoHS: Yes; ComponentLink1URL: https://datasheet.ciiva.com/16391/mic23150-16391945.pdf?src-supplier=Future+Electronics; ComponentLink1Description: https://datasheet.ciiva.com/16391/mic23150-16391945.pdf?src-supplier=Future+Electronics; Supplier Part Number 1: 576-3314-1-ND
U6 = TLA2024IRUGR: 12 BIT DELTA SIGMA ADC / I2C; Manufacturer: Texas Instruments; Number of Inputs: 4; Number of Bits: 12; Sampling Rate: 3300S/s; Number of A/D Converters: 1; Supplier 1: Digi-Key; Manufacturer Part Number: TLA2024IRUGR; RoHS: No; Category: Analog to Digital Converters (ADCs); Stock 1: 2199; Pricing 1: 1=1.77000, 10=1.59000, 25=1.50000, 100=1.20000, 250=1.05000, 500=1.02000, 1000=0.81000 (USD); Mount: Surface Mount; Min Operating Temperature: -40°C; Max Operating Temperature: 85°C; Interface: I2C; Packaging: Tape and Reel; ComponentLink1URL: http://www.ti.com/lit/ds/symlink/tla2021.pdf?src-supplier=Digi-Key; ComponentLink1Description: http://www.ti.com/lit/ds/symlink/tla2021.pdf?src-supplier=Digi-Key; Supplier Part Number 1: 296-51661-1-ND
U7 = DSC6083CE2A-032K768: MEMS OSC XO 32.7680KHZ CMOS SMD; Manufacturer: Microchip; Supplier 1: Digi-Key; Manufacturer Part Number: DSC6083CE2A-032K768; Stock 1: 500; Pricing 1: 1=0.90000, 25=0.74160, 100=0.67980 (USD); RoHS: No; ComponentLink1URL: http://www.microchip.com/mymicrochip/filehandler.aspx?ddocname=en587410&src-supplier=Digi-Key; ComponentLink1Description: http://www.microchip.com/mymicrochip/filehandler.aspx?ddocname=en587410&src-supplier=Digi-Key; Supplier Part Number 1: DSC6083CE2A-032K768-ND
Y1 Y3 = XTAL_4SMD: Crystal Oscillator (4 pin); Published: 8-Jun-2000; LatestRevisionDate: 17-Jul-2002; LatestRevisionNote: Re-released for DXP Platform.; PackageReference: R38; Publisher: Altium Limited; PackageDescription: Crystal, Thru-Hole; 2 Leads; Body 3.1 x 8.2 mm (Dia.xH)
  Y1: Supplier 1: Digi-Key; Supplier Part Number 1: 490-5576-1-ND
Y2 = XTAL: Crystal Oscillator (2 pin); Published: 8-Jun-2000; LatestRevisionDate: 17-Jul-2002; LatestRevisionNote: Re-released for DXP Platform.; PackageReference: R38; Publisher: Altium Limited; PackageDescription: Crystal, Thru-Hole; 2 Leads; Body 3.1 x 8.2 mm (Dia.xH); Supplier 1: Digi-Key; Supplier Part Number 1: 728-1074-1-ND